# EAGLE schematic tiny430-2 (EAGLE 6.3)
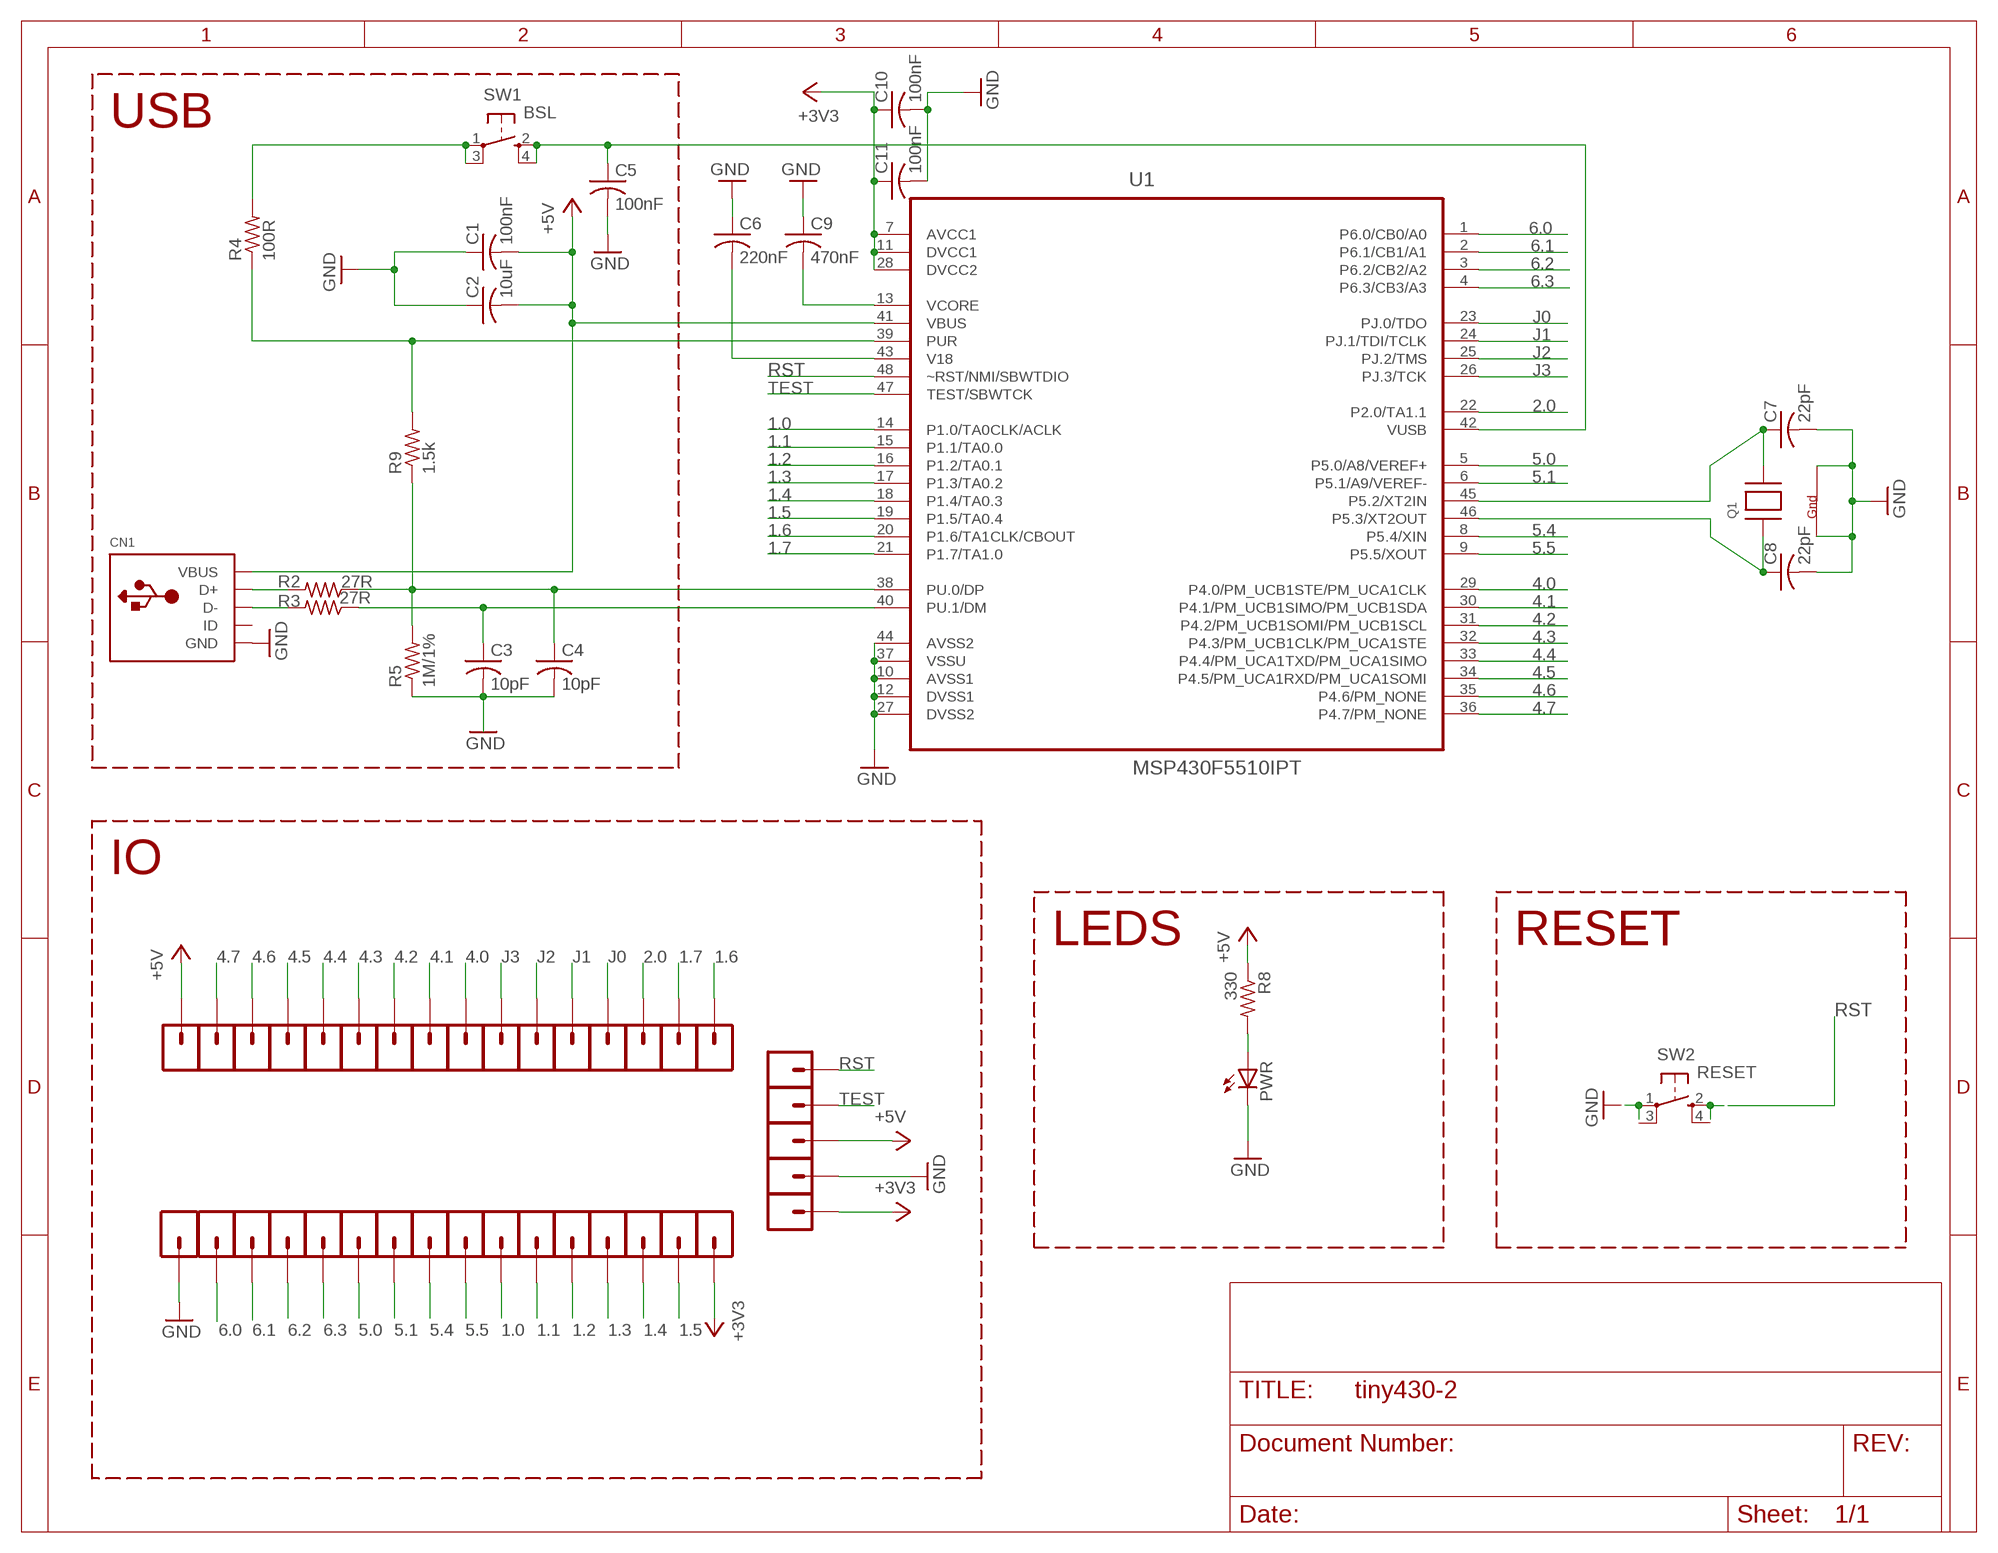
[diagram p0: schematic, sheet 1]

## Parts
C1  100nF  C-USC0603K  [C0603K]
C2  10uF  C-USC0603K  [C0603K]
C3  10pF  C-USC0402K  [C0402K]
C4  10pF  C-USC0402K  [C0402K]
C5  100nF  C-USC0603K  [C0603K]
C6  220nF  C-USC0402K  [C0402K]
C7  22pF  C-USC0402K  [C0402K]
C8  22pF  C-USC0402K  [C0402K]
C9  470nF  C-USC0402K  [C0402K]
C10  100nF  C-USC0603K  [C0603K]
C11  100nF  C-USC0603K  [C0603K]
CN1  USBMINIB  [USB-MINIB]
JP1  M01SMDNS  [1X01NS]
JP2  GND  M01SMDNS  [1X01NS]
JP3  M01SMDNS  [1X01NS]
JP4  M01SMDNS  [1X01NS]
JP5  M01SMDNS  [1X01NS]
JP6  M01SMDNS  [1X01NS]
JP7  M01SMDNS  [1X01NS]
JP8  M01SMDNS  [1X01NS]
JP9  M01SMDNS  [1X01NS]
JP10  M01SMDNS  [1X01NS]
JP11  M01SMDNS  [1X01NS]
JP12  M01SMDNS  [1X01NS]
JP13  M01SMDNS  [1X01NS]
JP14  M01SMDNS  [1X01NS]
JP15  M01SMDNS  [1X01NS]
JP16  M01SMDNS  [1X01NS]
JP17  M01SMDNS  [1X01NS]
JP18  M01SMDNS  [1X01NS]
JP19  M01SMDNS  [1X01NS]
JP20  M01SMDNS  [1X01NS]
JP21  M01SMDNS  [1X01NS]
JP22  M01SMDNS  [1X01NS]
JP23  M01SMDNS  [1X01NS]
JP24  M01SMDNS  [1X01NS]
JP25  M01SMDNS  [1X01NS]
JP26  M01SMDNS  [1X01NS]
JP27  M01SMDNS  [1X01NS]
JP28  M01SMDNS  [1X01NS]
JP29  M01SMDNS  [1X01NS]
JP30  M01SMDNS  [1X01NS]
JP31  M01SMDNS  [1X01NS]
JP32  M01SMDNS  [1X01NS]
JP33  M01SMDNS  [1X01NS]
JP34  M01SMDNS  [1X01NS]
JP35  M01SMDNS  [1X01NS]
JP36  M01SMDNS  [1X01NS]
JP37  M01SMDNS  [1X01NS]
PWR  LEDCHIPLED_0603  [CHIPLED_0603]
Q1  XTAL-4-3225  [NX3225]
R2  27R  R-US_R0402  [R0402]
R3  27R  R-US_R0402  [R0402]
R4  100R  R-US_R0402  [R0402]
R5  1M/1%  R-US_R0402  [R0402]
R8  330  R-US_R0402  [R0402]
R9  1.5k  R-US_R0402  [R0402]
SW1  BSL  SPST_TACT-KMR2  [KMR2]
SW2  RESET  SPST_TACT-KMR2  [KMR2]
U1  MSP430F5510IPT  [QFP50P900X900X160-48N]

## Nets
1.0: JP9.1 U1.14(P1.0/TA0CLK/ACLK)
1.1: JP10.1 U1.15(P1.1/TA0.0)
1.2: JP11.1 U1.16(P1.2/TA0.1)
1.3: JP12.1 U1.17(P1.3/TA0.2)
1.4: JP13.1 U1.18(P1.4/TA0.3)
1.5: JP14.1 U1.19(P1.5/TA0.4)
1.6: JP37.1 U1.20(P1.6/TA1CLK/CBOUT)
1.7: JP36.1 U1.21(P1.7/TA1.0)
2.0: JP35.1 U1.22(P2.0/TA1.1)
4.0: JP30.1 U1.29(P4.0/PM_UCB1STE/PM_UCA1CLK)
4.1: JP29.1 U1.30(P4.1/PM_UCB1SIMO/PM_UCB1SDA)
4.2: JP28.1 U1.31(P4.2/PM_UCB1SOMI/PM_UCB1SCL)
4.3: JP27.1 U1.32(P4.3/PM_UCB1CLK/PM_UCA1STE)
4.4: JP26.1 U1.33(P4.4/PM_UCA1TXD/PM_UCA1SIMO)
4.5: JP25.1 U1.34(P4.5/PM_UCA1RXD/PM_UCA1SOMI)
4.6: JP24.1 U1.35(P4.6/PM_NONE)
4.7: JP23.1 U1.36(P4.7/PM_NONE)
5.0: JP7.1 U1.5(P5.0/A8/VEREF+)
5.1: JP8.1 U1.6(P5.1/A9/VEREF-)
5.4: JP15.1 U1.8(P5.4/XIN)
5.5: JP16.1 U1.9(P5.5/XOUT)
6.0: JP3.1 U1.1(P6.0/CB0/A0)
6.1: JP4.1 U1.2(P6.1/CB1/A1)
6.2: JP5.1 U1.3(P6.2/CB2/A2)
6.3: JP6.1 U1.4(P6.3/CB3/A3)
+3V3: C10.1 C11.1 JP17.1 JP22.1 U1.7(AVCC1) U1.11(DVCC1) U1.28(DVCC2)
+5V: C1.2 C2.2 CN1.VBUS JP1.1 JP20.1 R8.1 U1.41(VBUS)
GND: C1.1 C2.1 C3.2 C4.2 C5.2 C6.1 C7.2 C8.2 C9.1 C10.2 C11.2 CN1.GND JP2.1 JP21.1 PWR.C Q1.2(G2) Q1.4(G1) R5.1 SW2.1(P) SW2.3(P1) U1.10(AVSS1) U1.12(DVSS1) U1.27(DVSS2) U1.37(VSSU) U1.44(AVSS2)
J0: JP34.1 U1.23(PJ.0/TDO)
J1: JP33.1 U1.24(PJ.1/TDI/TCLK)
J2: JP32.1 U1.25(PJ.2/TMS)
J3: JP31.1 U1.26(PJ.3/TCK)
N$1: CN1.D+ R2.2
N$2: CN1.D- R3.2
N$3: C6.2 U1.43(V18)
N$4: PWR.A R8.2
N$5: R4.1 R9.2 U1.39(PUR)
N$6: C5.1 SW1.2(S) SW1.4(S1) U1.42(VUSB)
N$7: R4.2 SW1.1(P) SW1.3(P1)
N$8: C9.2 U1.13(VCORE)
N$9: C3.1 R3.1 U1.40(PU.1/DM)
N$10: C4.1 R2.1 R5.2 R9.1 U1.38(PU.0/DP)
N$11: C7.1 Q1.3(X2) U1.45(P5.2/XT2IN)
N$12: C8.1 Q1.1(X1) U1.46(P5.3/XT2OUT)
RST: JP18.1 SW2.2(S) SW2.4(S1) U1.48(~RST/NMI/SBWTDIO)
TEST: JP19.1 U1.47(TEST/SBWTCK)
Unconnected: CN1.ID

## Notes on the sheet
- USB
- IO
- LEDS | RESET

## Library data of the parts
C1-C11 = adafruit:C-US: CAPACITOR, American symbol
CN1 = adafruit:USB: USB Connectors USBMINIB - Surface Mount Female Mini-B USB Connector 4UConnector: 06564 By microbuilder.eu Thru-hole RA Female Mini-B USB Connector 4UConnector: 18732 By ladyada.net
JP1-JP37 = smartmocha:M01: Header 1 Standard 1-pin 0.1" header. Use with straight break away headers (SKU : PRT-00116), right angle break away headers (PRT-00553), swiss pins (PRT-00743), machine pins (PRT-00117), and female headers (PRT-00115).
PWR = adafruit:LED: LED OSRAM: - CHIPLED LG R971, LG N971, LY N971, LG Q971, LY Q971, LO R971, LY R971 LH N974, LH R974 LS Q976, LO Q976, LY Q976 LO Q996 - Hyper CHIPLED LW Q18S LB Q993, LB Q99A, LB R99A - SideLED LS A670, LO A670, LY A670, LG A670, LP A670 LB A673, LV A673, LT A673, LW A673 LH A674 LY A675 LS A676, LA A676, LO A676, LY A676, LW A676 LS A679, LY A679, LG A679 - Hyper Micro SIDELED® LS Y876, LA Y876, LO Y876, LY Y876 LT Y87S - SmartLED LW L88C, LW L88S LB L89C, LB L89S, LG L890 LS L89K, LO L89K, LY L89K LS L896, LA L896, LO L896, LY L896 - TOPLED LS T670, LO T670, LY T670, LG T670, LP T670 LSG T670, LSP T670, LSY T670, LOP T670, LYG T670 LG T671, LOG T671, LSG T671 LB T673, LV T673, LT T673, LW T673 LH T674 LS T676, LA T676, LO T676, LY T676, LB T676, LH T676, LSB T676, LW T676 LB T67C, LV T67C, LT T67C, LS T67K, LO T67K, LY T67K, LW E67C LS E67B, LA E67B, LO E67B, LY E67B, LB E67C, LV E67C, LT E67C LW T67C LS T679, LY T679, LG T679 LS T770, LO T770, LY T770, LG T770, LP T770 LB T773, LV T773, LT T773, LW T773 LH T774 LS E675, LA E675, LY E675, LS T675 LS T776, LA T776, LO T776, LY T776, LB T776 LHGB T686 LT T68C, LB T68C - Hyper Mini TOPLED® LB M676 - Mini TOPLED Santana® LG M470 LS M47K, LO M47K, LY M47K Source: http://www.osram.convergy.de/
Q1 = adafruit:XTAL-4: Classic 4-pin 3.2 x 2.5mm crystal
R2-R5 R8 R9 = adafruit:R-US_: RESISTOR, American symbol
SW1 SW2 = adafruit:SPST_TACT: SMT 6mm switch, EVQQ2 series http://www.ladyada.net/library/eagle
U1 = Texas Instruments_By_element14_Batch_1:MSP430F5510IPT: MIXED SIGNAL MICROCONTROLLER; MPN: MSP430F5510IPT; OC_FARNELL: 1866799; OC_NEWARK: 47T2199; PACKAGE: QFP-48; SUPPLIER: TEXAS INSTRUMENTS